# Altium schematic sheet IPT-LXe Bottom.SchDoc
size 388 x 416 mm; SheetNumber: 0; SheetTotal: 0; PageSetup: Record=PageOptions|CenterHorizontal=True|CenterVertical=True|PrintScale=1.06|XCorrection=1.00|YCorrection=1.00|PrintKind=2|BorderSize=5000000|LeftOffset=0|BottomOffset=0|Orientation=1|PaperLength=1000|PaperWidth=1000|Scale=100|PaperSource=257|PrintQuality=600|MediaType=1|DitherType=10|PaperKind=A2|PrintScaleMode=1
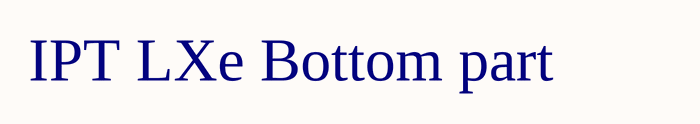
[diagram p0: IPT-LXe Bottom.SchDoc]

## Notes on the sheet
- IPT LXe Bottom part